# Altium project UKU20710_PROC.PrjPCB
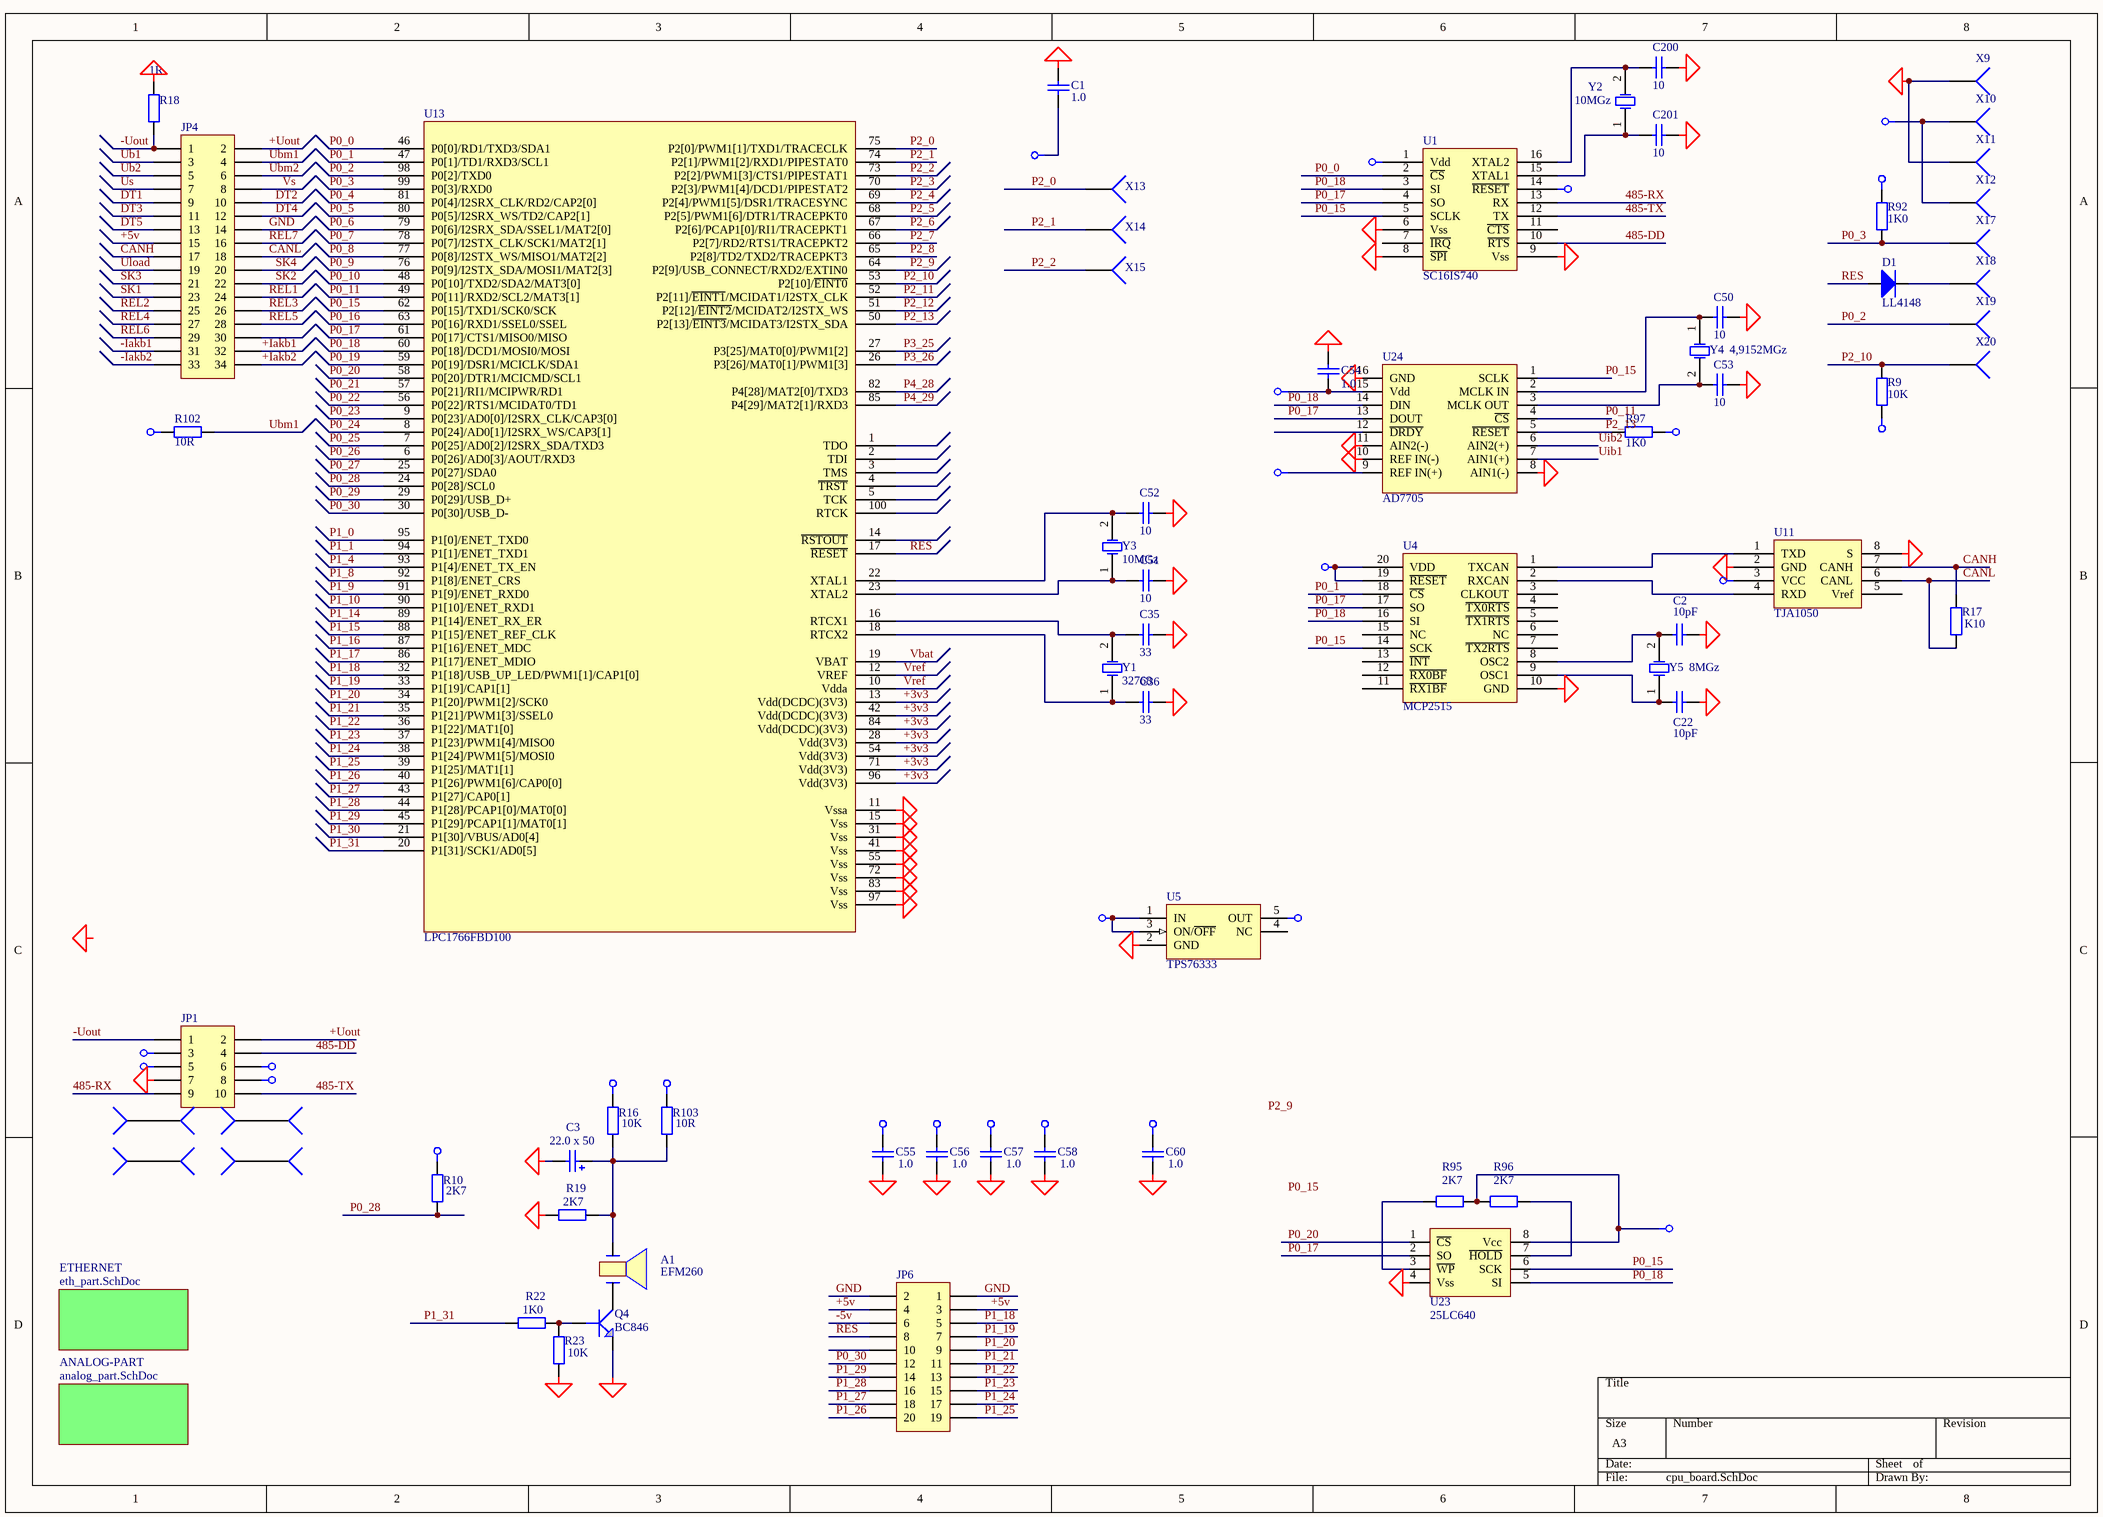
[diagram p0: cpu_board.SchDoc]
3 sheets, 212 parts. Net scope: global (net labels, ports and power ports of the same name join across sheets).
Board file: uku20710_proc.PcbDoc
Sheets:
  cpu_board.SchDoc
    ANALOG-PART = analog_part.SchDoc
    ETHERNET = eth_part.SchDoc

## Sheet cpu_board.SchDoc
size A3

### Parts
A1  EFM260  [Pjezo15]
C1  1.0  [_1206]
C2  value 10pF  [_1206]  (hidden comment: Cap Semi)
C3  22.0 x 50  [el3]
C22  value 10pF  [_1206]  (hidden comment: Cap Semi)
C35  33  [_1206]
C36  33  [_1206]
C50  10  [_1206]
C51  10  [_1206]
C52  10  [_1206]
C53  10  [_1206]
C54  1.0  [_1206]
C55  1.0  [_1206]
C56  1.0  [_1206]
C57  1.0  [_1206]
C58  1.0  [_1206]
C60  1.0  [_1206]
C200  10  [_1206]
C201  10  [_1206]
D1  LL4148  [_1206d]
JP1  PBD-10  [HDR2X5]  (value not drawn)
JP4  IDC34  [IDC34M]  (value not drawn)
JP6  PBD-20  [HDR2X10]  (value not drawn)
Q4  BC846  [SO-G3]
R9  10K  [_1206]
R10  2K7  [_1206]
R16  10K  [_1206]
R17  K10  [_1206]
R18  1R  [_1206]
R19  2K7  [_1206]
R22  1K0  [_1206]
R23  10K  [_1206]
R92  1K0  [_1206]
R95  2K7  [_1206]
R96  2K7  [_1206]
R97  1K0  [_1206]
R102  10R  [_1206]
R103  10R  [_1206]
U1  SC16IS740  [TSSO5X6-G16]
U4  MCP2515  [TSSO6X6-G20/D6.6]
U5  TPS76333  [SO-G5/P.95]
U11  TJA1050  [SO-G8/D5]
U13  LPC1766FBD100  [LPC2368]
U23  25LC640  [SO-G8/D5]
U24  AD7705  [SO-G16/D10.4]
X9  (no value)  [PIN1]
X10  (no value)  [PIN1]
X11  (no value)  [PIN1]
X12  (no value)  [PIN1]
X13  (no value)  [PIN1]
X14  (no value)  [PIN1]
X15  (no value)  [PIN1]
X16  (no value)  [PIN1]
X17  (no value)  [PIN1]
X18  (no value)  [PIN1]
X19  (no value)  [PIN1]
X20  (no value)  [PIN1]
X21  (no value)  [PIN1]
X22  (no value)  [PIN1]
X23  (no value)  [PIN1]
X24  (no value)  [PIN1]
X25  (no value)  [PIN1]
X26  (no value)  [PIN1]
X27  (no value)  [PIN1]
Y1  32768  [QWARZ2]
Y2  10MGz  [QWARZ1]
Y3  10MGz  [QWARZ1]
Y4  4,9152MGz  [QWARZ1]
Y5  8MGz  [QWARZ1]

### Sub-sheets
ANALOG-PART = analog_part.SchDoc: no entries
ETHERNET = eth_part.SchDoc: no entries

### Nets
+3v3: C1.1 C58.2 JP1.3 R9.1 R10.2 R92.2 U13.13(Vdd(DCDC)(3V3)) U13.28(Vdd(3V3)) U13.42(Vdd(DCDC)(3V3)) U13.54(Vdd(3V3)) U13.71(Vdd(3V3)) U13.84(Vdd(DCDC)(3V3)) U13.96(Vdd(3V3))
+5v: C54.2 C55.2 C57.2 C60.2 JP1.5 JP4.15 JP6.3 JP6.4 R95.2 R96.1 R97.2 R103.2 U1.1(Vdd) U1.14(~{RESET}) U4.19(~{RESET}) U4.20(VDD) U5.1(IN) U5.3(ON/~{OFF}) U11.3(VCC) U23.8(Vcc) U24.15(Vdd) X10.1 X12.1
+Uout: JP1.2 JP4.2 R16.2 R102.2
-5v: C56.2 JP1.8 JP6.6
GND: C1.2 C2.1 C3.2 C22.1 C35.1 C36.1 C50.1 C51.1 C52.1 C53.1 C54.1 C55.1 C56.1 C57.1 C58.1 C60.1 C200.1 C201.1 JP1.7 JP4.14 JP6.1 JP6.2 Q4.2(E) R18.2 R19.1 R23.1 U1.6(Vss) U1.8(~{SPI}) U1.9(Vss) U4.10(GND) U5.2(GND) U11.2(GND) U11.8(S) U13.11(Vssa) U13.15(Vss) U13.31(Vss) U13.41(Vss) U13.55(Vss) U13.72(Vss) U13.83(Vss) U13.97(Vss) U23.4(Vss) U24.8(AIN1(-)) U24.10(REF_IN(-)) U24.11(AIN2(-)) U24.16(GND) X9.1 X11.1
Vbat: JP1.6 U13.19(VBAT)
Vref: U5.5(OUT) U13.10(Vdda) U13.12(VREF) U24.9(REF_IN(+))
485-DD: JP1.4 U1.10(~{RTS})
485-RX: JP1.9 U1.13(RX)
485-TX: JP1.10 U1.12(TX)
+Iakb1: JP4.32
+Iakb2: JP4.34
-Iakb1: JP4.31
-Iakb2: JP4.33
-Uout: JP1.1 JP4.1 R18.1
CANH: JP4.17 R17.2 U11.7(CANH)
CANL: JP4.18 R17.1 U11.6(CANL)
DT1: JP4.9
DT2: JP4.10
DT3: JP4.11
DT4: JP4.12
DT5: JP4.13
P0_0: U1.2(~{CS}) U13.46(P0[0]/RD1/TXD3/SDA1)
P0_1: U4.18(~{CS}) U13.47(P0[1]/TD1/RXD3/SCL1)
P0_2: U13.98(P0[2]/TXD0) X19.1
P0_3: R92.1 U13.99(P0[3]/RXD0) X17.1
P0_4: U13.81(P0[4]/I2SRX_CLK/RD2/CAP2[0])
P0_5: U13.80(P0[5]/I2SRX_WS/TD2/CAP2[1])
P0_6: U13.79(P0[6]/I2SRX_SDA/SSEL1/MAT2[0])
P0_7: U13.78(P0[7]/I2STX_CLK/SCK1/MAT2[1])
P0_8: U13.77(P0[8]/I2STX_WS/MISO1/MAT2[2])
P0_9: U13.76(P0[9]/I2STX_SDA/MOSI1/MAT2[3])
P0_10: U13.48(P0[10]/TXD2/SDA2/MAT3[0])
P0_11: U13.49(P0[11]/RXD2/SCL2/MAT3[1]) U24.4(~{CS})
P0_15: U1.5(SCLK) U4.14(SCK) U13.62(P0[15]/TXD1/SCK0/SCK) U23.6(SCK) U24.1(SCLK)
P0_16: U13.63(P0[16]/RXD1/SSEL0/SSEL)
P0_17: U1.4(SO) U4.17(SO) U13.61(P0[17]/CTS1/MISO0/MISO) U23.2(SO) U24.13(DOUT)
P0_18: U1.3(SI) U4.16(SI) U13.60(P0[18]/DCD1/MOSI0/MOSI) U23.5(SI) U24.14(DIN)
P0_19: U13.59(P0[19]/DSR1/MCICLK/SDA1)
P0_20: U13.58(P0[20]/DTR1/MCICMD/SCL1) U23.1(~{CS})
P0_21: U13.57(P0[21]/RI1/MCIPWR/RD1)
P0_22: U13.56(P0[22]/RTS1/MCIDAT0/TD1)
P0_23: U13.9(P0[23]/AD0[0]/I2SRX_CLK/CAP3[0])
P0_24: U13.8(P0[24]/AD0[1]/I2SRX_WS/CAP3[1])
P0_25: U13.7(P0[25]/AD0[2]/I2SRX_SDA/TXD3)
P0_26: U13.6(P0[26]/AD0[3]/AOUT/RXD3)
P0_27: U13.25(P0[27]/SDA0)
P0_28: R10.1 U13.24(P0[28]/SCL0)
P0_29: U13.29(P0[29]/USB_D+)
P0_30: JP6.12 U13.30(P0[30]/USB_D-)
P1_0: U13.95(P1[0]/ENET_TXD0)
P1_1: U13.94(P1[1]/ENET_TXD1)
P1_4: U13.93(P1[4]/ENET_TX_EN)
P1_8: U13.92(P1[8]/ENET_CRS)
P1_9: U13.91(P1[9]/ENET_RXD0)
P1_10: U13.90(P1[10]/ENET_RXD1)
P1_14: U13.89(P1[14]/ENET_RX_ER)
P1_15: U13.88(P1[15]/ENET_REF_CLK)
P1_16: U13.87(P1[16]/ENET_MDC)
P1_17: U13.86(P1[17]/ENET_MDIO)
P1_18: JP6.5 U13.32(P1[18]/USB_UP_LED/PWM1[1]/CAP1[0])
P1_19: JP6.7 U13.33(P1[19]/CAP1[1])
P1_20: JP6.9 U13.34(P1[20]/PWM1[2]/SCK0)
P1_21: JP6.11 U13.35(P1[21]/PWM1[3]/SSEL0)
P1_22: JP6.13 U13.36(P1[22]/MAT1[0])
P1_23: JP6.15 U13.37(P1[23]/PWM1[4]/MISO0)
P1_24: JP6.17 U13.38(P1[24]/PWM1[5]/MOSI0)
P1_25: JP6.19 U13.39(P1[25]/MAT1[1])
P1_26: JP6.20 U13.40(P1[26]/PWM1[6]/CAP0[0])
P1_27: JP6.18 U13.43(P1[27]/CAP0[1])
P1_28: JP6.16 U13.44(P1[28]/PCAP1[0]/MAT0[0])
P1_29: JP6.14 U13.45(P1[29]/PCAP1[1]/MAT0[1])
P1_30: U13.21(P1[30]/VBUS/AD0[4])
P1_31: R22.1 U13.20(P1[31]/SCK1/AD0[5])
P2_0: U13.75(P2[0]/PWM1[1]/TXD1/TRACECLK) X13.1
P2_1: U13.74(P2[1]/PWM1[2]/RXD1/PIPESTAT0) X14.1
P2_2: U13.73(P2[2]/PWM1[3]/CTS1/PIPESTAT1) X15.1
P2_3: U13.70(P2[3]/PWM1[4]/DCD1/PIPESTAT2)
P2_4: U13.69(P2[4]/PWM1[5]/DSR1/TRACESYNC)
P2_5: U13.68(P2[5]/PWM1[6]/DTR1/TRACEPKT0)
P2_6: U13.67(P2[6]/PCAP1[0]/RI1/TRACEPKT1)
P2_7: U13.66(P2[7]/RD2/RTS1/TRACEPKT2)
P2_8: U13.65(P2[8]/TD2/TXD2/TRACEPKT3)
P2_9: U13.64(P2[9]/USB_CONNECT/RXD2/EXTIN0)
P2_10: R9.2 U13.53(P2[10]/~{EINT0}) X20.1
P2_11: U13.52(P2[11]/~{EINT1}/MCIDAT1/I2STX_CLK)
P2_12: U13.51(P2[12]/~{EINT2}/MCIDAT2/I2STX_WS)
P2_13: R97.1 U13.50(P2[13]/~{EINT3}/MCIDAT3/I2STX_SDA) U24.5(~{RESET})
P3_25: U13.27(P3[25]/MAT0[0]/PWM1[2])
P3_26: U13.26(P3[26]/MAT0[1]/PWM1[3])
P4_28: U13.82(P4[28]/MAT2[0]/TXD3)
P4_29: U13.85(P4[29]/MAT2[1]/RXD3)
REL1: JP4.24
REL2: JP4.25
REL3: JP4.26
REL4: JP4.27
REL5: JP4.28
REL6: JP4.29
REL7: JP4.16
RES: D1.1(A) JP6.8 U13.17(~{RESET})
SK1: JP4.23
SK2: JP4.22
SK3: JP4.21
SK4: JP4.20
Ub1: JP4.3
Ub2: JP4.5
Ubm1: JP4.4 R102.1
Ubm2: JP4.6
Uib1: U24.7(AIN1(+))
Uib2: U24.6(AIN2(+))
Uload: JP4.19
Us: JP4.7
Vs: JP4.8
NetA1_1: A1.1 Q4.3(C)
NetA1_2: A1.2 C3.1 R16.1 R19.2 R103.1
NetC2_2: C2.2 U4.8(OSC2) Y5.2(OSC2)
NetC22_2: C22.2 U4.9(OSC1) Y5.1(OSC1)
NetC35_2: C35.2 U13.16(RTCX1) Y1.2(OSC2)
NetC36_2: C36.2 U13.18(RTCX2) Y1.1(OSC1)
NetC50_2: C50.2 U24.2(MCLK_IN) Y4.1(OSC1)
NetC51_2: C51.2 U13.23(XTAL2) Y3.1(OSC1)
NetC52_2: C52.2 U13.22(XTAL1) Y3.2(OSC2)
NetC53_2: C53.2 U24.3(MCLK_OUT) Y4.2(OSC2)
NetC200_2: C200.2 U1.16(XTAL2) Y2.2(OSC2)
NetC201_2: C201.2 U1.15(XTAL1) Y2.1(OSC1)
NetD1_2: D1.2(K) X18.1
NetQ4_1: Q4.1(B) R22.2 R23.2
NetR95_1: R95.1 U23.3(~{WP})
NetR96_2: R96.2 U23.7(~{HOLD})
NetU4_1: U4.1(TXCAN) U11.1(TXD)
NetU4_2: U4.2(RXCAN) U11.4(RXD)
NetX16_1: X16.1 X22.1
NetX21_1: X21.1 X23.1
NetX24_1: X24.1 X26.1
NetX25_1: X25.1 X27.1

Not connected (* = marked no-connect by the designer): JP4 30; JP6 10; U1 7(~{IRQ}) 11(~{CTS}); U4 3(CLKOUT) 4(~{TX0RTS}) 5(~{TX1RTS}) 6(NC) 7(~{TX2RTS}) 11(~{RX1BF}) 12(~{RX0BF}) 13(~{INT}) 15(NC); U5 4(NC); U11 5(Vref); U13 1(TDO) 2(TDI) 3(TMS) 4(~{TRST}) 5(TCK) 14(~{RSTOUT}) 100(RTCK); U24 12(~{DRDY})

### Notes on the sheet
- Labels drawn without touching a wire or pin: GND, P0_15, P2_9

### Library data of the parts
A1 = PJEZ0: Beeper; Value: EFM260
C1 C54 = Cap Semi: Capacitor; Manufacturer: Generic Components; Class I: Passive; Value: 1,0; Published: 8-Jun-2000; Revision: July-2002: Re-released for DXP Platform.; Publisher: Altium Limited; Class II: Capacitor
C2 C22 = Cap Semi: Capacitor (Semiconductor SIM Model); Manufacturer: Generic Components; Class I: Passive; Published: 8-Jun-2000; Revision: July-2002: Re-released for DXP Platform.; Publisher: Altium Limited; Class II: Capacitor
C3 = Cap Pol1: Polarized Capacitor (Radial); Manufacturer: Generic Components; Class I: Passive; Value: 22,0x50; Published: 8-Jun-2000; Revision: July-2002: Re-released for DXP Platform.; Publisher: Altium Limited; Class II: Capacitor
C35 C36 = Cap Semi: Capacitor (Semiconductor SIM Model); Manufacturer: Generic Components; Class I: Passive; Value: 15pF; Published: 8-Jun-2000; Revision: July-2002: Re-released for DXP Platform.; Publisher: Altium Limited; Class II: Capacitor
C50-C53 C200 C201 = Cap Semi: Capacitor; Manufacturer: Generic Components; Class I: Passive; Value: 15pF; Published: 8-Jun-2000; Revision: July-2002: Re-released for DXP Platform.; Publisher: Altium Limited; Class II: Capacitor
C55-C58 C60 = Cap Semi: Capacitor; Manufacturer: Generic Components; Class I: Passive; Value: 0,1; Published: 8-Jun-2000; Revision: July-2002: Re-released for DXP Platform.; Publisher: Altium Limited; Class II: Capacitor
D1 = Diode: Manufacturer: Generic Components; Class I: Discrete; Class II: Diode - Switching; Published: 8-Jun-2000; Revision: July-2002: Re-released for DXP Platform.; Publisher: Altium Limited; Value: LL4148
JP1 = Header 5X2: Header, 5-Pin, Dual row; Manufacturer: Generic Components; Class I: Connector; Revision: July-2002: Re-released for DXP Platform.; Publisher: Altium Limited
JP4 = Header 17X2: Header, 17-Pin, Dual row; Manufacturer: Generic Components; Class I: Connector; Revision: July-2002: Re-released for DXP Platform.; Publisher: Altium Limited
JP6 = Header 10X2: Header, 10-Pin, Dual row; Manufacturer: Generic Components; Class I: Connector; Revision: July-2002: Re-released for DXP Platform.; Publisher: Altium Limited
Q4 = GT122: Bipolar transistor; Right: 20; Bottom: 20; Value: BC846
R9 R16 R18 R19 R22 R92 R95 R96 = Res2: Resistor; Manufacturer: Generic Components; Class I: Passive; Rule: Undefined; Published: 8-Jun-2000; Revision: July-2002: Re-released for DXP Platform.; Publisher: Altium Limited; Class II: Resistor
  R9 R16: Value: 10K
  R18: Value: 1R
  R19 R95 R96: Value: 2K7
  R22 R92: Value: 1K0
R10 R102 R103 = Res2: Resistor; Manufacturer: Generic Components; Class I: Passive; Value: 10K; Rule: Undefined; Published: 8-Jun-2000; Revision: July-2002: Re-released for DXP Platform.; Publisher: Altium Limited; Class II: Resistor
R17 = Res2: Resistor; Manufacturer: Generic Components; Class I: Passive; Value: 120; Published: 8-Jun-2000; Revision: July-2002: Re-released for DXP Platform.; Publisher: Altium Limited; Class II: Resistor
R23 = Res2: Resistor; Manufacturer: Generic Components; Class I: Passive; Published: 8-Jun-2000; Revision: July-2002: Re-released for DXP Platform.; Publisher: Altium Limited; Class II: Resistor; Value: 10K
R97 = Res2: Resistor; Manufacturer: Generic Components; Class I: Passive; Value: 1K; Published: 8-Jun-2000; Revision: July-2002: Re-released for DXP Platform.; Publisher: Altium Limited; Class II: Resistor
U5 = LP2980AIM5-3.3: Voltage Regulator; Manufacturer: National Semiconductor; Package Information: Latest Revision: Aug-1999; Class I: Power Management; Published: 15-Apr-2002; Datasheet: Latest Revision: Oct-1999; Package Reference: MA05B; Publisher: Altium Limited; Class II: Voltage Regulator; Value: TPS76333
U13 = LPC2368FBD100
U23 = 25LC640: Memory; Value: 26LC640
U24 = AD7705: ADC; Value: AD7705
X9-X27 = Socket: Manufacturer: Generic Components; Class I: Connector; Revision: July-2002: Re-released for DXP Platform.; Publisher: Altium Limited
Y1-Y5 = XTAL: Crystal Oscillator; Manufacturer: Generic Components; Published: 8-Jun-2000; Revision: July-2002: Re-released for DXP Platform.; Publisher: Altium Limited; Class I: Oscillator; Class II: Crystal Oscillator
  Y2 Y3: Value: 10MGz
  Y4: Value: 4,9152MGz

## Sheet analog_part.SchDoc
size A3
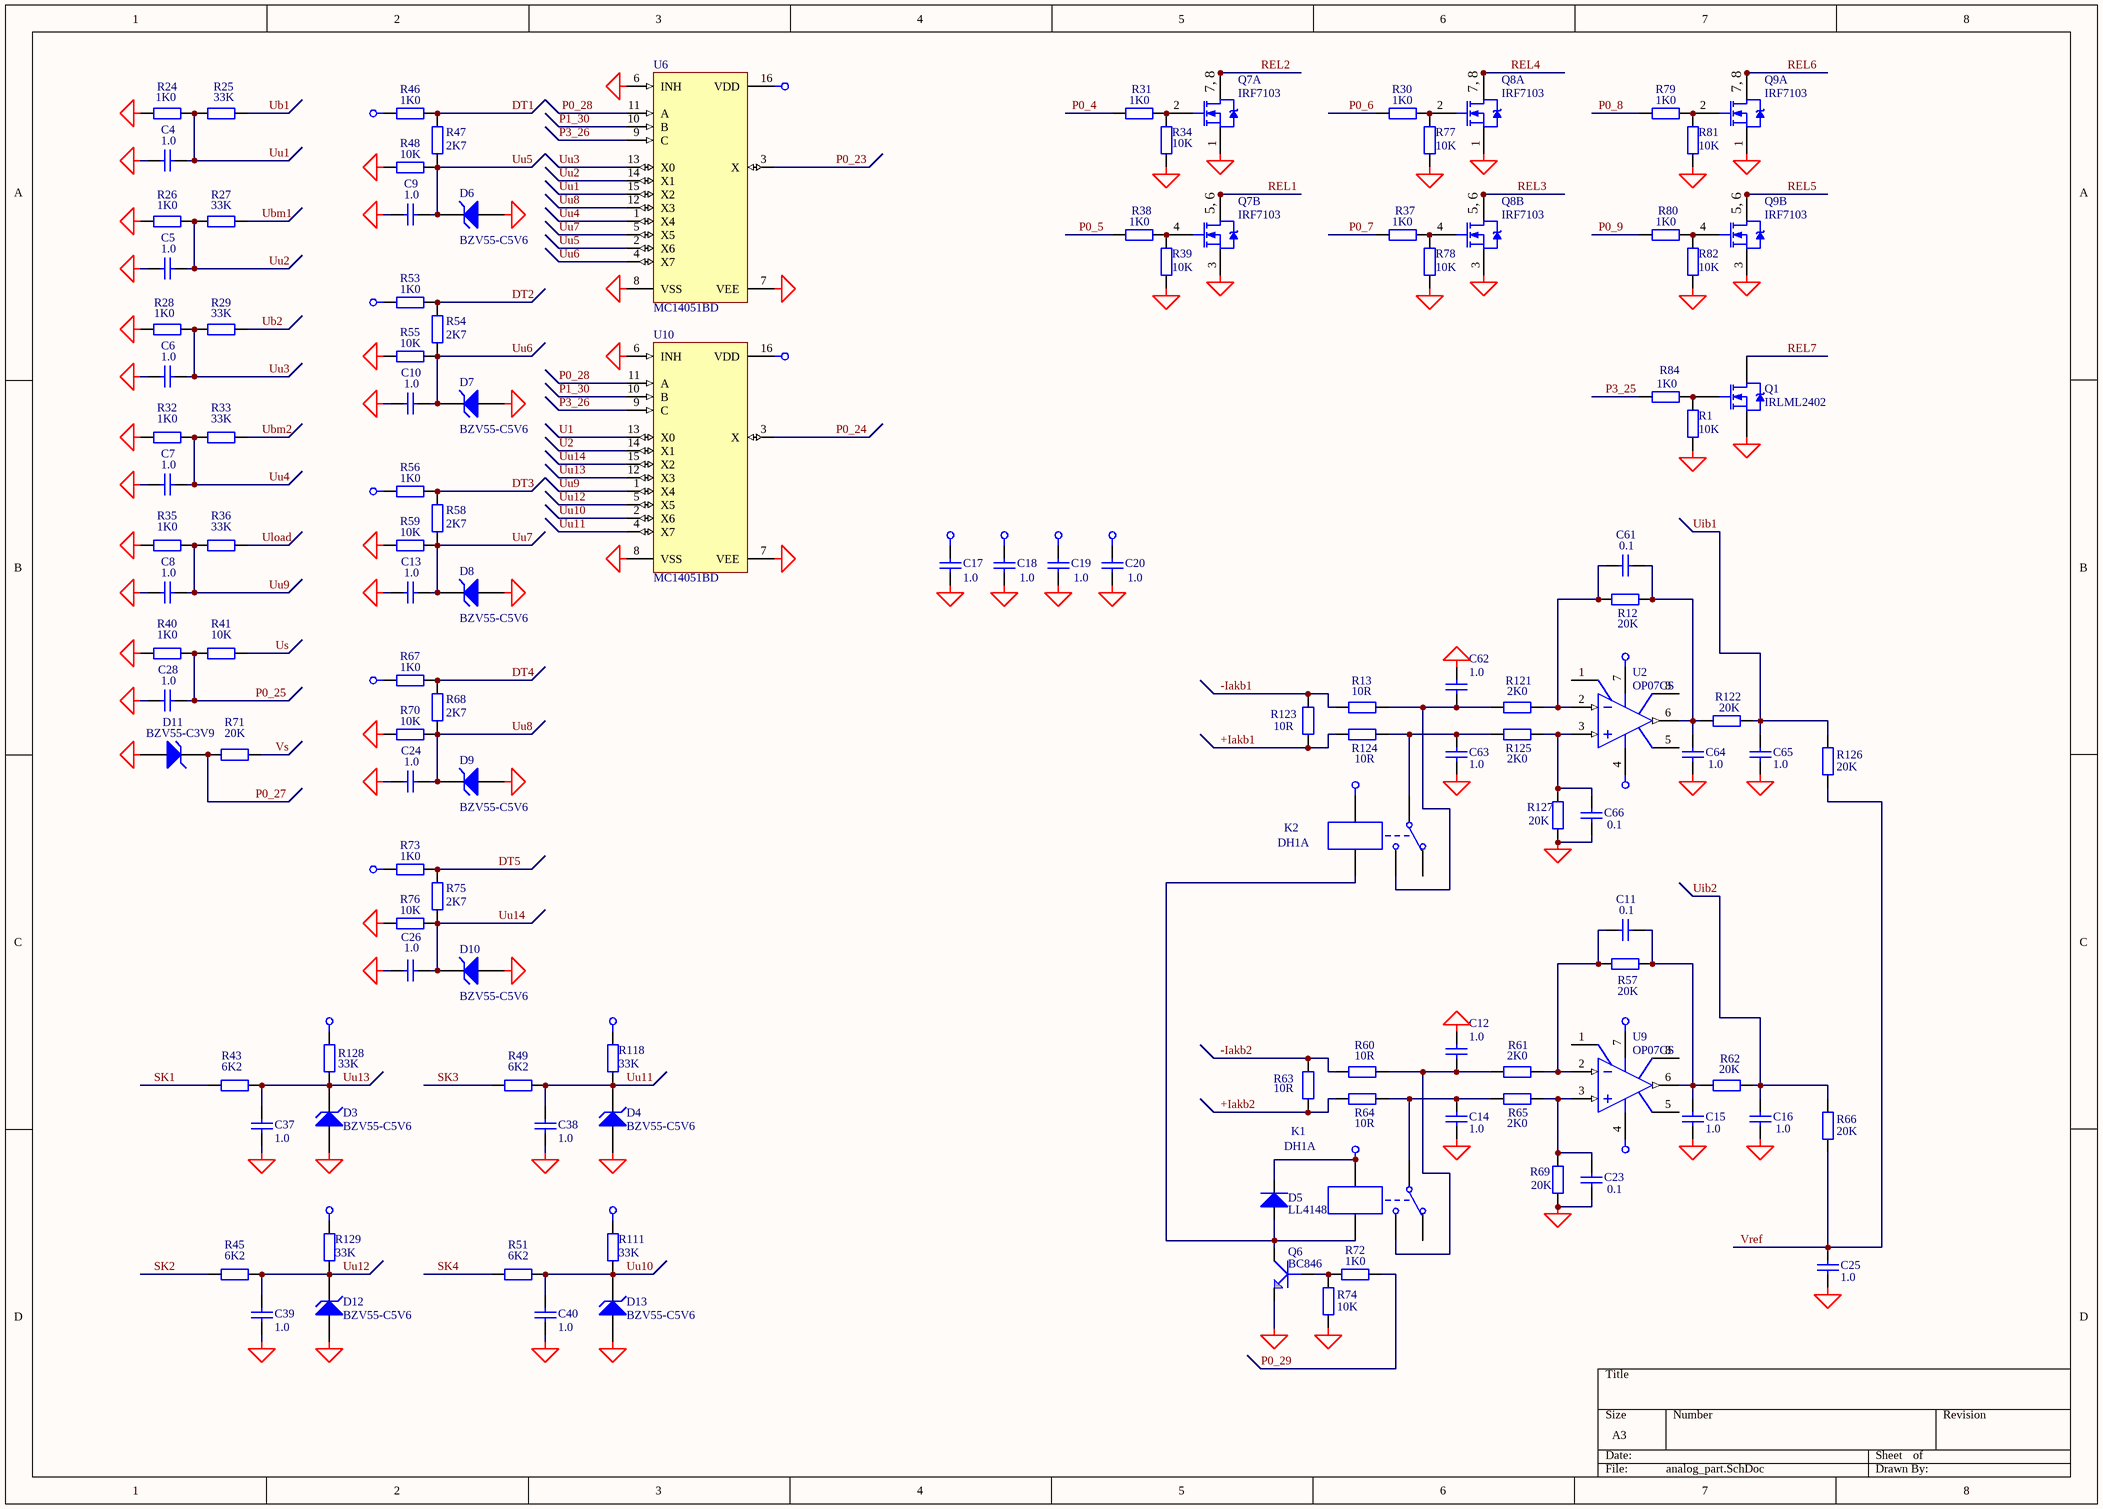
[diagram p1: analog_part.SchDoc]

### Parts
C4  1.0  [_1206]
C5  1.0  [_1206]
C6  1.0  [_1206]
C7  1.0  [_1206]
C8  1.0  [_1206]
C9  1.0  [_1206]
C10  1.0  [_1206]
C11  0.1  [_1206]
C12  1.0  [_1206]
C13  1.0  [_1206]
C14  1.0  [_1206]
C15  1.0  [_1206]
C16  1.0  [_1206]
C17  1.0  [_1206]
C18  1.0  [_1206]
C19  1.0  [_1206]
C20  1.0  [_1206]
C23  0.1  [_1206]
C24  1.0  [_1206]
C25  1.0  [_1206]
C26  1.0  [_1206]
C28  1.0  [_1206]
C37  1.0  [_1206]
C38  1.0  [_1206]
C39  1.0  [_1206]
C40  1.0  [_1206]
C61  0.1  [_1206]
C62  1.0  [_1206]
C63  1.0  [_1206]
C64  1.0  [_1206]
C65  1.0  [_1206]
C66  0.1  [_1206]
D3  BZV55-C5V6  [_1206d]
D4  BZV55-C5V6  [_1206d]
D5  LL4148  [_1206d]
D6  BZV55-C5V6  [_1206d]
D7  BZV55-C5V6  [_1206d]
D8  BZV55-C5V6  [_1206d]
D9  BZV55-C5V6  [_1206d]
D10  BZV55-C5V6  [_1206d]
D11  BZV55-C3V9  [_1206d]
D12  BZV55-C5V6  [_1206d]
D13  BZV55-C5V6  [_1206d]
K1  DH1A  [kuan]
K2  DH1A  [kuan]
Q1  IRLML2402  [SO-G3/Z3.3]
Q6  BC846  [SO-G3]
Q7  IRF7103  [SO-G8/Y2.2]  (parts A,B of 2)
Q8  IRF7103  [SO-G8/Y2.2]  (parts A,B of 2)
Q9  IRF7103  [SO-G8/Y2.2]  (parts A,B of 2)
R1  10K  [_1206]
R12  20K  [_1206]
R13  10R  [_1206]
R24  1K0  [_1206]
R25  33K  [_1206]
R26  1K0  [_1206]
R27  33K  [_1206]
R28  1K0  [_1206]
R29  33K  [_1206]
R30  1K0  [_1206]
R31  1K0  [_1206]
R32  1K0  [_1206]
R33  33K  [_1206]
R34  10K  [_1206]
R35  1K0  [_1206]
R36  33K  [_1206]
R37  1K0  [_1206]
R38  1K0  [_1206]
R39  10K  [_1206]
R40  1K0  [_1206]
R41  10K  [_1206]
R43  6K2  [_1206]
R45  6K2  [_1206]
R46  1K0  [_0805]
R47  2K7  [_1206]
R48  10K  [_1206]
R49  6K2  [_1206]
R51  6K2  [_1206]
R53  1K0  [_0805]
R54  2K7  [_1206]
R55  10K  [_1206]
R56  1K0  [_0805]
R57  20K  [_1206]
R58  2K7  [_1206]
R59  10K  [_1206]
R60  10R  [_1206]
R61  2K0  [_1206]
R62  20K  [_1206]
R63  10R  [_1206]
R64  10R  [_1206]
R65  2K0  [_1206]
R66  20K  [_1206]
R67  1K0  [_0805]
R68  2K7  [_1206]
R69  20K  [_1206]
R70  10K  [_1206]
R71  20K  [_1206]
R72  1K0  [_1206]
R73  1K0  [_0805]
R74  10K  [_1206]
R75  2K7  [_1206]
R76  10K  [_1206]
R77  10K  [_1206]
R78  10K  [_1206]
R79  1K0  [_1206]
R80  1K0  [_1206]
R81  10K  [_1206]
R82  10K  [_1206]
R84  1K0  [_1206]
R111  33K  [_1206]
R118  33K  [_1206]
R121  2K0  [_1206]
R122  20K  [_1206]
R123  10R  [_1206]
R124  10R  [_1206]
R125  2K0  [_1206]
R126  20K  [_1206]
R127  20K  [_1206]
R128  33K  [_1206]
R129  33K  [_1206]
U2  OP07CS  [SO-G8]
U6  MC14051BD  [SO-G16/C5.85]
U9  OP07CS  [SO-G8]
U10  MC14051BD  [SO-G16/C5.85]

### Nets
+3v3: R111.1 R118.1 R128.1 R129.1
+5v: C17.2 C19.2 D5.2(K) K1.4 K2.4 R46.2 R53.2 R56.2 R67.2 R73.2 U2.7(V+) U6.16(VDD) U9.7(V+) U10.16(VDD)
-5v: C18.2 U2.4(V-) U9.4(V-)
GND: C4.2 C5.2 C6.2 C7.2 C8.2 C9.2 C10.2 C12.1 C13.2 C14.1 C15.1 C16.1 C17.1 C18.1 C19.1 C20.1 C23.2 C24.2 C25.1 C26.2 C28.2 C37.2 C38.2 C39.2 C40.2 C62.1 C63.1 C64.1 C65.1 C66.2 D3.1(A) D4.1(A) D6.1(A) D7.1(A) D8.1(A) D9.1(A) D10.1(A) D11.1(A) D12.1(A) D13.1(A) Q1.2(S) Q6.2(E) Q7.1(S) Q7.3(S) Q8.1(S) Q8.3(S) Q9.1(S) Q9.3(S) R1.1 R24.2 R26.2 R28.2 R32.2 R34.1 R35.2 R39.1 R40.2 R48.1 R55.1 R59.1 R69.1 R70.1 R74.1 R76.1 R77.1 R78.1 R81.1 R82.1 R127.1 U6.6(INH) U6.7(VEE) U6.8(VSS) U10.6(INH) U10.7(VEE) U10.8(VSS)
Vref: C20.2 C25.2 R66.2 R126.2
+Iakb1: R123.1 R124.2
+Iakb2: R63.1 R64.2
-Iakb1: R13.2 R123.2
-Iakb2: R60.2 R63.2
DT1: R46.1 R47.1
DT2: R53.1 R54.1
DT3: R56.1 R58.1
DT4: R67.1 R68.1
DT5: R73.1 R75.1
P0_4: R31.1
P0_5: R38.1
P0_6: R30.1
P0_7: R37.1
P0_8: R79.1
P0_9: R80.1
P0_23: U6.3(X)
P0_24: U10.3(X)
P0_25: C28.1 R40.1 R41.1
P0_27: D11.2(K) R71.1
P0_28: U6.11(A) U10.11(A)
P0_29: R72.1
P1_30: U6.10(B) U10.10(B)
P3_25: R84.1
P3_26: U6.9(C) U10.9(C)
REL1: Q7.5(D) Q7.6(D)
REL2: Q7.7(D) Q7.8(D)
REL3: Q8.5(D) Q8.6(D)
REL4: Q8.7(D) Q8.8(D)
REL5: Q9.5(D) Q9.6(D)
REL6: Q9.7(D) Q9.8(D)
REL7: Q1.3(D)
SK1: R43.1
SK2: R45.1
SK3: R49.1
SK4: R51.1
U1: U10.13(X0)
U2: U10.14(X1)
Ub1: R25.2
Ub2: R29.2
Ubm1: R27.2
Ubm2: R33.2
Uib1: C65.2 R122.2 R126.1
Uib2: C16.2 R62.2 R66.1
Uload: R36.2
Us: R41.2
Uu1: C4.1 R24.1 R25.1 U6.15(X2)
Uu2: C5.1 R26.1 R27.1 U6.14(X1)
Uu3: C6.1 R28.1 R29.1 U6.13(X0)
Uu4: C7.1 R32.1 R33.1 U6.1(X4)
Uu5: C9.1 D6.2(K) R47.2 R48.2 U6.2(X6)
Uu6: C10.1 D7.2(K) R54.2 R55.2 U6.4(X7)
Uu7: C13.1 D8.2(K) R58.2 R59.2 U6.5(X5)
Uu8: C24.1 D9.2(K) R68.2 R70.2 U6.12(X3)
Uu9: C8.1 R35.1 R36.1 U10.1(X4)
Uu10: C40.1 D13.2(K) R51.2 R111.2 U10.2(X6)
Uu11: C38.1 D4.2(K) R49.2 R118.2 U10.4(X7)
Uu12: C39.1 D12.2(K) R45.2 R129.2 U10.5(X5)
Uu13: C37.1 D3.2(K) R43.2 R128.2 U10.12(X3)
Uu14: C26.1 D10.2(K) R75.2 R76.2 U10.15(X2)
Vs: R71.2
NetC11_1: C11.1 C15.2 R57.2 R62.1 U9.6(OUT)
NetC11_2: C11.2 R57.1 R61.2 U9.2(IN-)
NetC12_2: C12.2 K1.3 R60.1 R61.1
NetC14_2: C14.2 K1.1 R64.1 R65.1
NetC23_1: C23.1 R65.2 R69.2 U9.3(IN+)
NetC61_1: C61.1 C64.2 R12.2 R122.1 U2.6(OUT)
NetC61_2: C61.2 R12.1 R121.2 U2.2(IN-)
NetC62_2: C62.2 K2.3 R13.1 R121.1
NetC63_2: C63.2 K2.1 R124.1 R125.1
NetC66_1: C66.1 R125.2 R127.2 U2.3(IN+)
NetD5_1: D5.1(A) K1.5 K2.5 Q6.3(C)
NetQ1_1: Q1.1(G) R1.2 R84.2
NetQ6_1: Q6.1(B) R72.2 R74.2
NetQ7_2: Q7.2(G) R31.2 R34.2
NetQ7_4: Q7.4(G) R38.2 R39.2
NetQ8_2: Q8.2(G) R30.2 R77.2
NetQ8_4: Q8.4(G) R37.2 R78.2
NetQ9_2: Q9.2(G) R79.2 R81.2
NetQ9_4: Q9.4(G) R80.2 R82.2

Not connected (* = marked no-connect by the designer): K1 2; K2 2; U2 1(VOSTRIM) 5(NC) 8(VOSTRIM); U9 1(VOSTRIM) 5(NC) 8(VOSTRIM)

### Notes on the sheet
- (in symbol IRF7301, part A) 7, 8
- (in symbol IRF7301, part B) 5, 6

### Library data of the parts
C4-C10 C12-C16 C24-C26 C28 C37-C40 C62-C65 = Cap Semi: as C1 on sheet cpu_board; Published: 8-Jun-2000; Revision: July-2002: Re-released for DXP Platform.; Publisher: Altium Limited; Class II: Capacitor
C11 C17-C20 C23 C61 C66 = Cap Semi: as C55 on sheet cpu_board; Published: 8-Jun-2000; Revision: July-2002: Re-released for DXP Platform.; Publisher: Altium Limited; Class II: Capacitor
D3 D4 D6-D10 D12 D13 = D Zener: Zener Diode; Manufacturer: Generic Components; Class I: Discrete; Class II: Diode - Zener; Value: BZV55C5V6; Published: 8-Jun-2000; Revision: July-2002: Re-released for DXP Platform.; Publisher: Altium Limited
D5 = Diode: as D1 on sheet cpu_board; Published: 8-Jun-2000; Revision: July-2002: Re-released for DXP Platform.; Publisher: Altium Limited; Value: LL4148
D11 = D Zener: Zener Diode; Manufacturer: Generic Components; Class I: Discrete; Class II: Diode - Zener; Value: BZV55C3V9; Published: 8-Jun-2000; Revision: July-2002: Re-released for DXP Platform.; Publisher: Altium Limited
K1 K2 = BS115: Relay; Manufacturer: Generic Components; Class I: Electro-mechanical; Published: 24-Mar-1999; Revision: July-2002: Re-released for DXP Platform.; Publisher: Altium Limited; Class II: Relay; Value: DH1A
Q1 = IRLML2402: HEXFET Power MOSFET; Manufacturer: International Rectifier; Class I: Discrete; Class II: MOSFET - Power; Published: 8-Jun-2000; Revision: July-2002: Re-released for DXP Platform.; Datasheet: Latest Revision: Aug-1997; Package Reference: SOT-23; Publisher: Altium Limited
Q6 = GT122: Bipolar transistor; Right: 20; Bottom: 20; Value: BC846
Q7-Q9 = IRF7301: FET; Manufacturer: International Rectifier; Revision 1: 29-Sep-2000: Re-orientated a 'Drain' pin on first part.; Revision 2: July-2002: Re-released for DXP Platform.; Class I: Discrete; Class II: MOSFET - Power; Published: 8-Jun-2000; Datasheet: Latest Revision: Aug-1997; Package Reference: SOIC8; Publisher: Altium Limited; Value: IRF7103
R1 R13 R24-R41 R43 R45-R49 R51 R53-R56 R58-R60 R63 R64 R67 R68 R70-R73 R75-R82 R123 R124 = Res2: as R9 on sheet cpu_board; Published: 8-Jun-2000; Revision: July-2002: Re-released for DXP Platform.; Publisher: Altium Limited; Class II: Resistor
  R1 R34 R39 R41 R48 R55 R59 R70 R76-R78 R81 R82: Value: 10K
  R13 R60 R63 R64 R123 R124: Value: 10R
  R24 R26 R28 R30-R32 R35 R37 R38 R40 R46 R53 R56 R67 R72 R73 R79 R80: Value: 1K0
  R25 R27 R29 R33 R36: Value: 33K
  R43 R45 R49 R51: Value: 6K2
  R47 R54 R58 R68 R75: Value: 2K7
  R71: Value: 20K
R12 R57 R61 R62 R65 R66 R69 R74 R121 R122 R125-R127 = Res2: as R23 on sheet cpu_board; Published: 8-Jun-2000; Revision: July-2002: Re-released for DXP Platform.; Publisher: Altium Limited; Class II: Resistor
  R12 R57 R62 R66 R69 R122 R126 R127: Value: 20K
  R61 R65 R121 R125: Value: 2K0
  R74: Value: 10K
R84 = Res2: Resistor; Manufacturer: Generic Components; Class I: Passive; Value: 20K; Rule: Undefined; Published: 8-Jun-2000; Revision: July-2002: Re-released for DXP Platform.; Publisher: Altium Limited; Class II: Resistor
R111 R118 R128 R129 = Res2: Resistor; Manufacturer: Generic Components; Class I: Passive; Value: 1K0; Rule: Undefined; Published: 8-Jun-2000; Revision: July-2002: Re-released for DXP Platform.; Publisher: Altium Limited; Class II: Resistor
U2 U9 = OP07CS: Operational Amplifier; Manufacturer: Analog Devices; Note: Pin 5 is not connected.; Published: 8-Jun-2000; Revision: July-2002: Re-released for DXP Platform.; Datasheet: Designer's Reference Manual CD (1992); Package Reference: SO-8B; Publisher: Altium Limited; Class I: Amplifier; Class II: Operational Amplifier; Value: OP07CS
U6 U10 = MC14051BD: Multiplexer; Manufacturer: ON Semiconductor; Class I: Logic; Class II: Multiplexer/Encoder/Selector; Value: 4051; Published: 15-Apr-2002; Package Reference: 751B-05; Publisher: Altium Limited

## Sheet eth_part.SchDoc
size A3
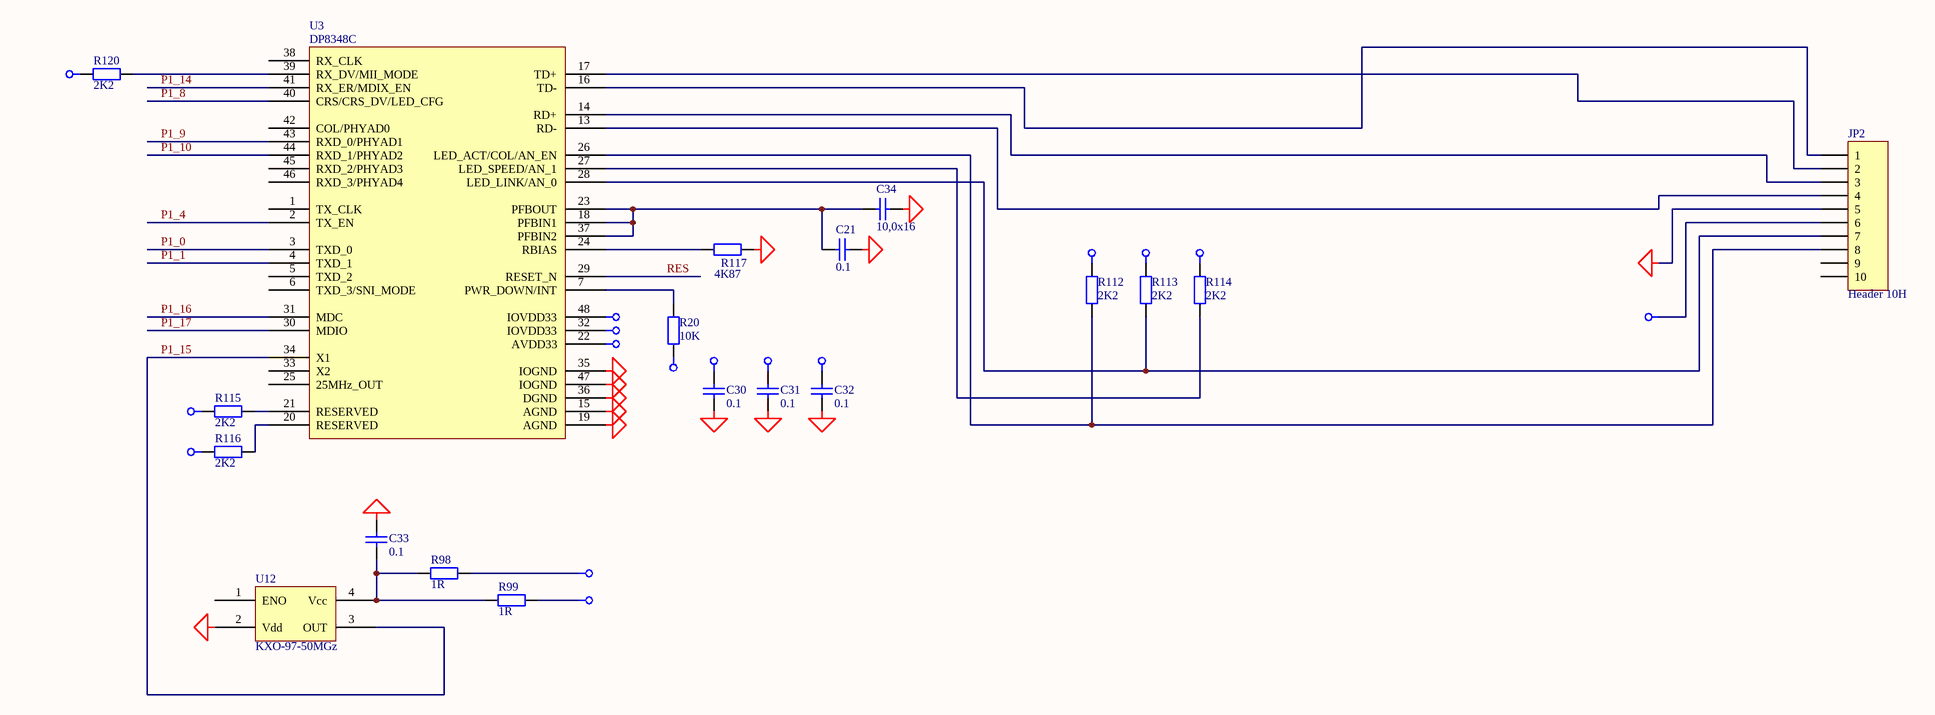
[diagram p2: eth_part.SchDoc]

### Parts
C21  0.1  [C3216-1206]
C30  0.1  [_1206]
C31  0.1  [_1206]
C32  0.1  [_1206]
C33  0.1  [_1206]
C34  10,0x16  [C3216-1206]
JP2  Header 10H  [HDR2X5]
R20  10K  [_1206]
R98  1R  [_1206]
R99  1R  [_1206]
R112  2K2  [_1206]
R113  2K2  [_1206]
R114  2K2  [_1206]
R115  2K2  [_1206]
R116  2K2  [_1206]
R117  4K87  [_1206]
R120  2K2  [_1206]
U3  DP8348C  [F-QFP7X7-G48/N]
U12  KXO-97-50MGz  [KXO-97]

### Nets
+3v3: C30.1 C31.1 C32.1 JP2.6 R20.2 R99.2 R112.2 R113.2 R114.2 R115.2 R116.2 R120.2 U3.22(AVDD33) U3.32(IOVDD33) U3.48(IOVDD33)
+5v: R98.2
GND: C21.2 C30.2 C31.2 C32.2 C33.2 C34.2 JP2.5 R117.1 U3.15(AGND) U3.19(AGND) U3.35(IOGND) U3.36(DGND) U3.47(IOGND) U12.2(Vdd)
P1_0: U3.3(TXD_0)
P1_1: U3.4(TXD_1)
P1_4: U3.2(TX_EN)
P1_8: U3.40(CRS/CRS_DV/LED_CFG)
P1_9: U3.43(RXD_0/PHYAD1)
P1_10: U3.44(RXD_1/PHYAD2)
P1_14: U3.41(RX_ER/MDIX_EN)
P1_15: U3.34(X1) U12.3(OUT)
P1_16: U3.31(MDC)
P1_17: U3.30(MDIO)
RES: U3.29(RESET_N)
NetC21_1: C21.1 C34.1 U3.18(PFBIN1) U3.23(PFBOUT) U3.37(PFBIN2)
NetC33_1: C33.1 R98.1 R99.1 U12.4(Vcc)
NetJP2_1: JP2.1 U3.16(TD-)
NetJP2_2: JP2.2 U3.17(TD+)
NetJP2_3: JP2.3 U3.14(RD+)
NetJP2_4: JP2.4 U3.13(RD-)
NetJP2_7: JP2.7 R113.1 U3.28(LED_LINK/AN_0)
NetJP2_8: JP2.8 R112.1 U3.26(LED_ACT/COL/AN_EN)
NetR20_1: R20.1 U3.7(PWR_DOWN/INT)
NetR114_1: R114.1 U3.27(LED_SPEED/AN_1)
NetR115_1: R115.1 U3.21(RESERVED)
NetR116_1: R116.1 U3.20(RESERVED)
NetR117_2: R117.2 U3.24(RBIAS)
NetR120_1: R120.1 U3.39(RX_DV/MII_MODE)

Not connected (* = marked no-connect by the designer): JP2 9 10; U3 1(TX_CLK) 5(TXD_2) 6(TXD_3/SNI_MODE) 25(25MHz_OUT) 33(X2) 38(RX_CLK) 42(COL/PHYAD0) 45(RXD_2/PHYAD3) 46(RXD_3/PHYAD4); U12 1(ENO)

### Library data of the parts
C21 C30-C34 = Cap Semi: Capacitor (Semiconductor SIM Model); Manufacturer: Generic Components; Class I: Passive; Value: 1,0; Published: 8-Jun-2000; Revision: July-2002: Re-released for DXP Platform.; Publisher: Altium Limited; Class II: Capacitor
JP2 = Header 10H: Header, 10-Pin, Right Angle; Manufacturer: Generic Components; Class I: Connector; Revision: July-2002: Re-released for DXP Platform.; Publisher: Altium Limited
R20 = Res2: as R9 on sheet cpu_board; Published: 8-Jun-2000; Revision: July-2002: Re-released for DXP Platform.; Publisher: Altium Limited; Class II: Resistor; Value: 10K
R98 R99 R112-R117 R120 = Res2: as R10 on sheet cpu_board; Published: 8-Jun-2000; Revision: July-2002: Re-released for DXP Platform.; Publisher: Altium Limited; Class II: Resistor
U12 = KXO-97

## Nets that join several sheets
+3v3: cpu_board (13 pins), analog_part (R111.1 R118.1 R128.1 R129.1), eth_part (15 pins)
+5v: cpu_board (23 pins), analog_part (14 pins), eth_part (R98.2)
-5v: cpu_board (C56.2 JP1.8 JP6.6), analog_part (C18.2 U2.4 U9.4)
GND: cpu_board (48 pins), analog_part (75 pins), eth_part (14 pins)
Vref: cpu_board (U5.5 U13.10 U13.12 U24.9), analog_part (C20.2 C25.2 R66.2 R126.2)
+Iakb1: cpu_board (JP4.32), analog_part (R123.1 R124.2)
+Iakb2: cpu_board (JP4.34), analog_part (R63.1 R64.2)
-Iakb1: cpu_board (JP4.31), analog_part (R13.2 R123.2)
-Iakb2: cpu_board (JP4.33), analog_part (R60.2 R63.2)
DT1: cpu_board (JP4.9), analog_part (R46.1 R47.1)
DT2: cpu_board (JP4.10), analog_part (R53.1 R54.1)
DT3: cpu_board (JP4.11), analog_part (R56.1 R58.1)
DT4: cpu_board (JP4.12), analog_part (R67.1 R68.1)
DT5: cpu_board (JP4.13), analog_part (R73.1 R75.1)
P0_4: cpu_board (U13.81), analog_part (R31.1)
P0_5: cpu_board (U13.80), analog_part (R38.1)
P0_6: cpu_board (U13.79), analog_part (R30.1)
P0_7: cpu_board (U13.78), analog_part (R37.1)
P0_8: cpu_board (U13.77), analog_part (R79.1)
P0_9: cpu_board (U13.76), analog_part (R80.1)
P0_23: cpu_board (U13.9), analog_part (U6.3)
P0_24: cpu_board (U13.8), analog_part (U10.3)
P0_25: cpu_board (U13.7), analog_part (C28.1 R40.1 R41.1)
P0_27: cpu_board (U13.25), analog_part (D11.2 R71.1)
P0_28: cpu_board (R10.1 U13.24), analog_part (U6.11 U10.11)
P0_29: cpu_board (U13.29), analog_part (R72.1)
P1_0: cpu_board (U13.95), eth_part (U3.3)
P1_1: cpu_board (U13.94), eth_part (U3.4)
P1_4: cpu_board (U13.93), eth_part (U3.2)
P1_8: cpu_board (U13.92), eth_part (U3.40)
P1_9: cpu_board (U13.91), eth_part (U3.43)
P1_10: cpu_board (U13.90), eth_part (U3.44)
P1_14: cpu_board (U13.89), eth_part (U3.41)
P1_15: cpu_board (U13.88), eth_part (U3.34 U12.3)
P1_16: cpu_board (U13.87), eth_part (U3.31)
P1_17: cpu_board (U13.86), eth_part (U3.30)
P1_30: cpu_board (U13.21), analog_part (U6.10 U10.10)
P3_25: cpu_board (U13.27), analog_part (R84.1)
P3_26: cpu_board (U13.26), analog_part (U6.9 U10.9)
REL1: cpu_board (JP4.24), analog_part (Q7.5 Q7.6)
REL2: cpu_board (JP4.25), analog_part (Q7.7 Q7.8)
REL3: cpu_board (JP4.26), analog_part (Q8.5 Q8.6)
REL4: cpu_board (JP4.27), analog_part (Q8.7 Q8.8)
REL5: cpu_board (JP4.28), analog_part (Q9.5 Q9.6)
REL6: cpu_board (JP4.29), analog_part (Q9.7 Q9.8)
REL7: cpu_board (JP4.16), analog_part (Q1.3)
RES: cpu_board (D1.1 JP6.8 U13.17), eth_part (U3.29)
SK1: cpu_board (JP4.23), analog_part (R43.1)
SK2: cpu_board (JP4.22), analog_part (R45.1)
SK3: cpu_board (JP4.21), analog_part (R49.1)
SK4: cpu_board (JP4.20), analog_part (R51.1)
Ub1: cpu_board (JP4.3), analog_part (R25.2)
Ub2: cpu_board (JP4.5), analog_part (R29.2)
Ubm1: cpu_board (JP4.4 R102.1), analog_part (R27.2)
Ubm2: cpu_board (JP4.6), analog_part (R33.2)
Uib1: cpu_board (U24.7), analog_part (C65.2 R122.2 R126.1)
Uib2: cpu_board (U24.6), analog_part (C16.2 R62.2 R66.1)
Uload: cpu_board (JP4.19), analog_part (R36.2)
Us: cpu_board (JP4.7), analog_part (R41.2)
Vs: cpu_board (JP4.8), analog_part (R71.2)